# Altium schematic sheet TinyArduino.SchDoc
size A4; SheetNumber: 1; SheetTotal: 1
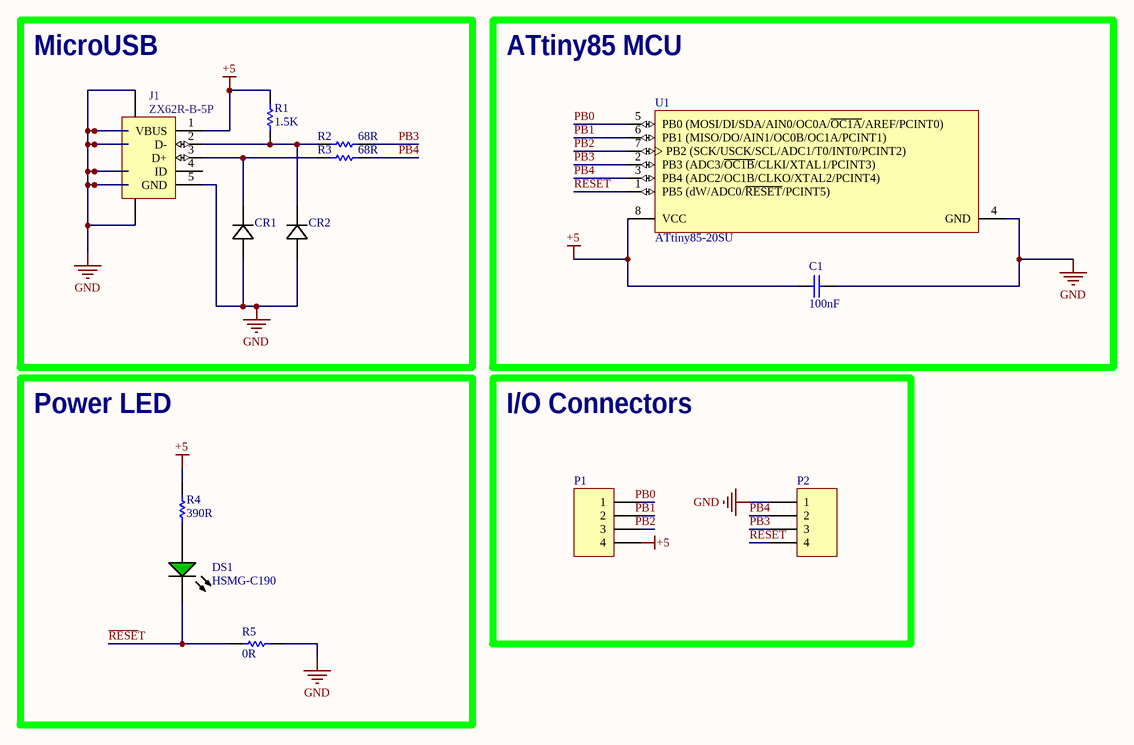
[diagram p0: TinyArduino.SchDoc]

## Parts
C1  100nF  [MY_0603]
CR1  B0540WS-7  [SOD323_DIO]  (value not drawn)
CR2  B0540WS-7  [SOD323_DIO]  (value not drawn)
DS1  HSMG-C190  [AVAG-HSMX-C190_V]
J1  ZX62R-B-5P  [HIRO-ZX62R-B-5P_V]
P1  Header 4  [My_1X04]  (value not drawn)
P2  Header 4  [My_1X04]  (value not drawn)
R1  1.5K  [MY_0603]
R2  68R  [MY_0603]
R3  68R  [MY_0603]
R4  390R  [MY_0603]
R5  0R  [MY_0603]
U1  ATtiny85-20SU  [ATML-8S2_M]

## Blocks framed on the sheet
MicroUSB: CR1 CR2 J1 R1-R3
ATtiny85 MCU: C1 U1
Power LED: DS1 R4 R5
I/O Connectors: P1 P2

## Nets
+5: C1.1 J1.1(VBUS) P1.4 R1.2 R4.2 U1.8(VCC)
GND: C1.2 CR1.2 CR2.2 J1.5(GND) J1.6(SHLD) J1.7(SHLD) J1.8(SHLD) J1.9(SHLD) J1.10(SHLD) J1.11(SHLD) P2.1 R5.1 U1.4(GND)
~{RESE}T: DS1.2(K) R5.2
PB0: U1.5(PB0_(MOSI/DI/SDA/AIN0/OC0A/~{OC1A}/AREF/PCINT0))
PB1: U1.6(PB1_(MISO/DO/AIN1/OC0B/OC1A/PCINT1))
PB2: U1.7(PB2_(SCK/USCK/SCL/ADC1/T0/INT0/PCINT2))
PB3: P2.3 R2.2 U1.2(PB3_(ADC3/~{OC1B}/CLKI/XTAL1/PCINT3))
PB4: P2.2 R3.2 U1.3(PB4_(ADC2/OC1B/CLKO/XTAL2/PCINT4))
RESET: P2.4 U1.1(PB5_(dW/ADC0/~{RESET}/PCINT5))
NetCR1_1: CR1.1 J1.3(D+) R3.1
NetCR2_1: CR2.1 J1.2(D-) R1.1 R2.1
NetDS1_1: DS1.1(A) R4.1

Not connected (* = marked no-connect by the designer): J1 4(ID); P1 1 2 3

## Notes on the sheet
- Labels drawn without touching a wire or pin: PB0, PB1, PB2

## Library data of the parts
C1 = Cap ceramic: None polar capacitor; ASiD Part Number: C-AS; Value: 100nF
CR1 CR2 = B0540WS-7: No Description Available; Mfr_Name: Diodes Inc; Type: DEV; Copyright: Copyright (C) 2023 Ultra Librarian. All rights reserved.; Manufacturer_Part_Number: B0540WS-7; RefDes: RefDes
DS1 = CMP-007-00013-2: LED Uni-Color Green, 52 mW, 20 mA, -40 to 85 degC, 2-Pin SMD, RoHS, Tape and Reel; Manufacturer: Avago; Forward Current: 20mA; Viewing Angle: 170degrees; Luminous Intensity: 15mcd; Lens Style: Diffused; Forward Voltage: 2.2V; Power: 52mW; Mounting Technology: SM; RoHS Compliant: True; Packaging: TapeandReel; Illumination Colour: Green; Datasheet URL: http://docs.avagotech.com/docs/AV02-0551EN; Min Operating Temperature: -40°C; Max Operating Temperature: 85°C; Pins: 2; Package Description: 2-Pin Surface Mount Device, Body 1.6 x 0.8 mm, Height 0.9 mm; Nominal Vf: 2.2V; Case/Package: 0603; Manufacturer URL: http://www.avagotech.com/; Datasheet Version: Mar-12; Colour: Green; Package Reference: HSMX-C190; Package Quantity: 4000
J1 = CMP-0031-00001-1: Connector; USBMicro-B,Reverse type, SMT; 5 Position; Right Angle; DatasheetVersion: 08/2010; Operating Temperature: -30 to 85 degC; Mounting Technology: Surface Mount; PartNumber: ZX62R-B-5P; PackageReference: ZX62R-B-5P; ComponentLink2URL: http://www.hirose.co.jp/cataloge_hp/e24200011.pdf; ComponentLink1URL: http://www.hirose.com/â€Ž; ComponentLink2Description: Datasheet; PackageDescription: 5-Pin USB Micro-B R/A Connector; ComponentLink1Description: Manufacturer URL
P1 P2 = Header 4: Header, 4-Pin; ASiD Part Number: Header 4-AS
R1-R5 = Res: Standard resistor; ASiD Part Number: Res-AS
  R1: Value: 1.5K
  R2 R3: Value: 68R
  R4: Value: 390R
  R5: Value: 0R
U1 = CMP-020-00006-3: 8-bit AVR Microcontroller with In-System Programmable Flash, 2.7 to 5.5 V, 20 MHz, 8 KB Flash, 0.5 KB EEPROM, 0.5 KB SRAM, -40 to 85 degC, 8-Pin SOIC (8S2), RoHS, Tube; Manufacturer: Atmel; ADC Channels: 4; Max Supply Voltage: 5.5V; PWM Channels: 6; UART Channels: 1; Interface: SPI; USB Channels: 0; Min Supply Voltage: 2.7V; Frequency: 20MHz; RAM Size: 512B; Density: 8KB; Datasheet Version: Rev. 2586Q, 08/2013; Package Quantity: 95; RoHS Compliant: True; Manufacturer URL: http://www.atmel.com/; Datasheet URL: http://www.atmel.com/Images/Atmel-2586-AVR-8-bit-Microcontroller-ATtiny25-ATtiny45-ATtiny85_Datasheet.pdf; Package Description: 8-Pin Small Outline Integrated Circuit Package, Body 5.29 x 5.24 mm, Pitch 1.27 mm; Mounting Technology: SM; Max Operating Temperature: 85°C; Case/Package: SOIC; I/Os: 6; Max Clock Frequency: 20MHz; Packaging: Rail/Tube; Min Operating Temperature: -40°C; Pins: 8; Package Reference: 8S2